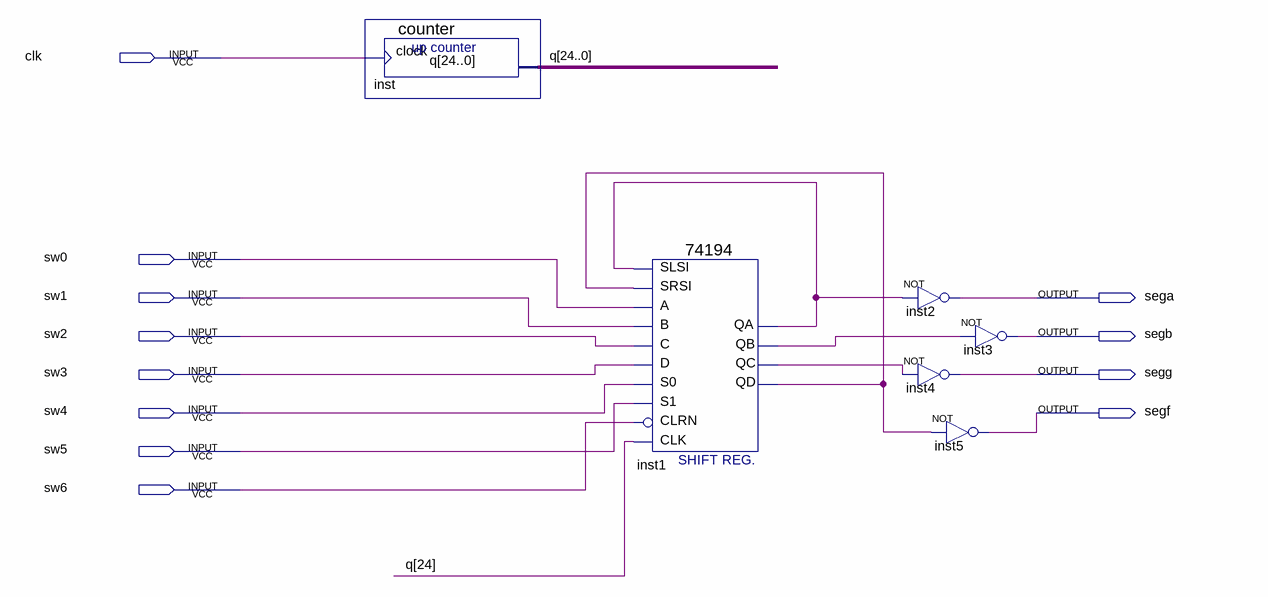
[diagram p0: schematic sheet]
// Quartus schematic shift_register.bdf as structural Verilog: 6 symbols, 12 pins
module shift_register (
  input  clk,
  input  sw0,
  input  sw1,
  input  sw2,
  input  sw3,
  input  sw4,
  input  sw5,
  input  sw6,
  output sega,
  output segb,
  output segg,
  output segf
);

  wire inst1_qa, inst1_qb, inst1_qc, inst1_qd;
  wire [24:0] q;

  counter inst (.clock(clk), .q(q));
  \74194  inst1 (
    .SLSI(inst1_qa), .SRSI(inst1_qd), .B(sw1), .C(sw2), .CLK(q[24]), .CLRN(sw6), .D(sw3), .S1(sw5), .S0(sw4),
    .A(sw0), .QA(inst1_qa), .QB(inst1_qb), .QC(inst1_qc), .QD(inst1_qd));
  not inst2 (sega, inst1_qa);
  not inst3 (segb, inst1_qb);
  not inst4 (segg, inst1_qc);
  not inst5 (segf, inst1_qd);
endmodule
